# EAGLE design snow_@ (EAGLE 5.11)

## Sheet 1 of 3
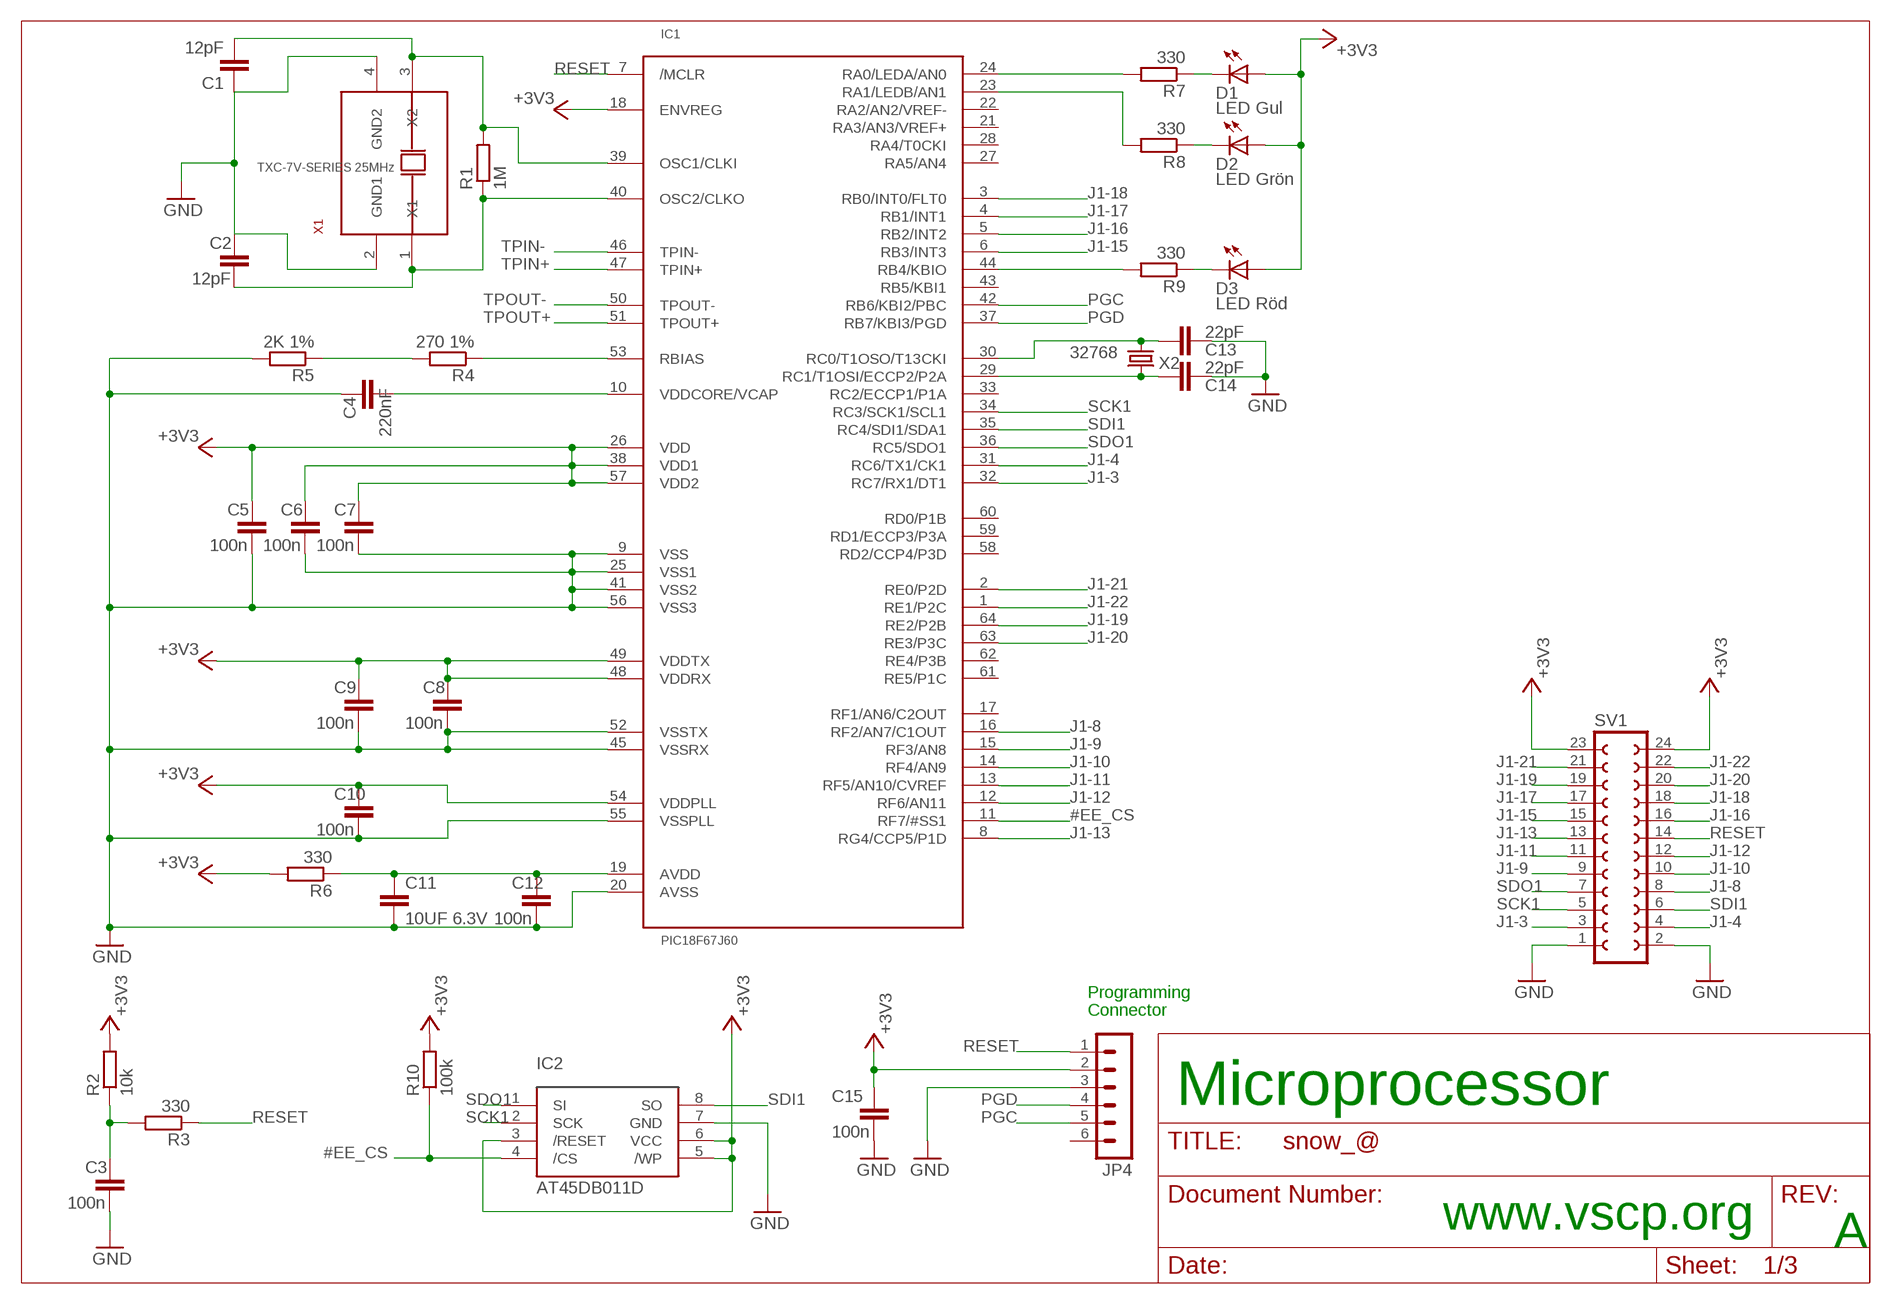
[diagram p0: schematic, sheet 1]

### Parts
C1  12pF  C-EUC0805  [C0805]
C2  12pF  C-EUC0805  [C0805]
C3  100n  C-EUC0805  [C0805]
C4  220nF  C-EUC0805  [C0805]
C5  100n  C-EUC0805  [C0805]
C6  100n  C-EUC0805  [C0805]
C7  100n  C-EUC0805  [C0805]
C8  100n  C-EUC0805  [C0805]
C9  100n  C-EUC0805  [C0805]
C10  100n  C-EUC0805  [C0805]
C11  10UF 6.3V  C-EUC2012  [C2012]
C12  100n  C-EUC0805  [C0805]
C13  22pF  C-EUC0805  [C0805]
C14  22pF  C-EUC0805  [C0805]
C15  100n  C-EUC0805  [C0805]
D1  LED Gul  LED_2012  [C2012]
D2  LED Grön  LED_2012  [C2012]
D3  LED Röd  LED_2012  [C2012]
IC1  PIC18F67J60  [TQFP64-10X10]
IC2  AT45DB011D  [SOP8]
JP4  MA06-1  [MA06-1]
R1  1M  R-EU_M0805  [M0805]
R2  10k  R-EU_M0805  [M0805]
R3  330  R-EU_M0805  [M0805]
R4  270 1%  R-EU_M0805  [M0805]
R5  2K 1%  R-EU_M0805  [M0805]
R6  330  R-EU_M0805  [M0805]
R7  330  R-EU_M0805  [M0805]
R8  330  R-EU_M0805  [M0805]
R9  330  R-EU_M0805  [M0805]
R10  100k  R-EU_M0805  [M0805]
SV1  FE12-2  [FE12-2]
X1  TXC-7V-SERIES 25MHz  TXC-7V-SERIES  [TXC-7V-SERIES]
X2  32768  CRYSTALTC26H  [TC26H]

### Nets
#EE_CS: IC1.11(RF7/#SS1) IC2.4(/CS) R10.1
+3V3: C5.1 C6.1 C7.1 C8.1 C9.1 C10.1 C15.1 D1.1(A) D2.1(A) D3.1(A) IC1.18(ENVREG) IC1.26(VDD) IC1.38(VDD1) IC1.48(VDDRX) IC1.49(VDDTX) IC1.54(VDDPLL) IC1.57(VDD2) IC2.3(/RESET) IC2.5(/WP) IC2.6(VCC) JP4.2 R2.2 R6.2 R10.2 SV1.23 SV1.24 ; also sheet 2,3
GND: C1.1 C2.1 C3.2 C4.1 C5.2 C6.2 C7.2 C8.2 C9.2 C10.2 C11.2 C12.2 C13.1 C14.1 C15.2 IC1.9(VSS) IC1.20(AVSS) IC1.25(VSS1) IC1.41(VSS2) IC1.45(VSSRX) IC1.52(VSSTX) IC1.55(VSSPLL) IC1.56(VSS3) IC2.7(GND) JP4.3 R5.2 SV1.1 SV1.2 X1.2(GND1) X1.4(GND2) ; also sheet 2,3
J1-3: IC1.32(RC7/RX1/DT1) SV1.3
J1-4: IC1.31(RC6/TX1/CK1) SV1.4
J1-8: IC1.16(RF2/AN7/C1OUT) SV1.8
J1-9: IC1.15(RF3/AN8) SV1.9
J1-10: IC1.14(RF4/AN9) SV1.10
J1-11: IC1.13(RF5/AN10/CVREF) SV1.11
J1-12: IC1.12(RF6/AN11) SV1.12
J1-13: IC1.8(RG4/CCP5/P1D) SV1.13
J1-15: IC1.6(RB3/INT3) SV1.15
J1-16: IC1.5(RB2/INT2) SV1.16
J1-17: IC1.4(RB1/INT1) SV1.17
J1-18: IC1.3(RB0/INT0/FLT0) SV1.18
J1-19: IC1.64(RE2/P2B) SV1.19
J1-20: IC1.63(RE3/P3C) SV1.20
J1-21: IC1.2(RE0/P2D) SV1.21
J1-22: IC1.1(RE1/P2C) SV1.22
N$3: C1.2 IC1.39(OSC1/CLKI) R1.2 X1.3(X2)
N$4: C2.2 IC1.40(OSC2/CLKO) R1.1 X1.1(X1)
N$5: IC1.53(RBIAS) R4.1
N$6: R4.2 R5.1
N$7: C14.2 IC1.29(RC1/T1OSI/ECCP2/P2A) X2.2
N$8: C3.1 R2.1 R3.2
N$9: C4.2 IC1.10(VDDCORE/VCAP)
N$10: C13.2 IC1.30(RC0/T1OSO/T13CKI) X2.1
N$11: IC1.24(RA0/LEDA/AN0) R7.2
N$12: IC1.23(RA1/LEDB/AN1) R8.2
N$13: IC1.44(RB4/KBIO) R9.2
N$14: D3.2(C) R9.1
N$15: D2.2(C) R8.1
N$16: D1.2(C) R7.1
N$23: C11.1 C12.1 IC1.19(AVDD) R6.1
PGC: IC1.42(RB6/KBI2/PBC) JP4.5
PGD: IC1.37(RB7/KBI3/PGD) JP4.4
RESET: IC1.7(/MCLR) JP4.1 R3.1 SV1.14
SCK1: IC1.34(RC3/SCK1/SCL1) IC2.2(SCK) SV1.5
SDI1: IC1.35(RC4/SDI1/SDA1) IC2.8(SO) SV1.6
SDO1: IC1.36(RC5/SDO1) IC2.1(SI) SV1.7
TPIN+: IC1.47(TPIN+)
TPIN-: IC1.46(TPIN-)
TPOUT+: IC1.51(TPOUT+)
TPOUT-: IC1.50(TPOUT-)
Unconnected: IC1.17(RF1/AN6/C2OUT) IC1.21(RA3/AN3/VREF+) IC1.22(RA2/AN2/VREF-) IC1.27(RA5/AN4) IC1.28(RA4/T0CKI) IC1.33(RC2/ECCP1/P1A) IC1.43(RB5/KBI1) IC1.58(RD2/CCP4/P3D) IC1.59(RD1/ECCP3/P3A) IC1.60(RD0/P1B) IC1.61(RE5/P1C) IC1.62(RE4/P3B) JP4.6

### Notes on the sheet
- Programming
- Connector
- Microprocessor
- www.vscp.org
- A

## Sheet 2 of 3
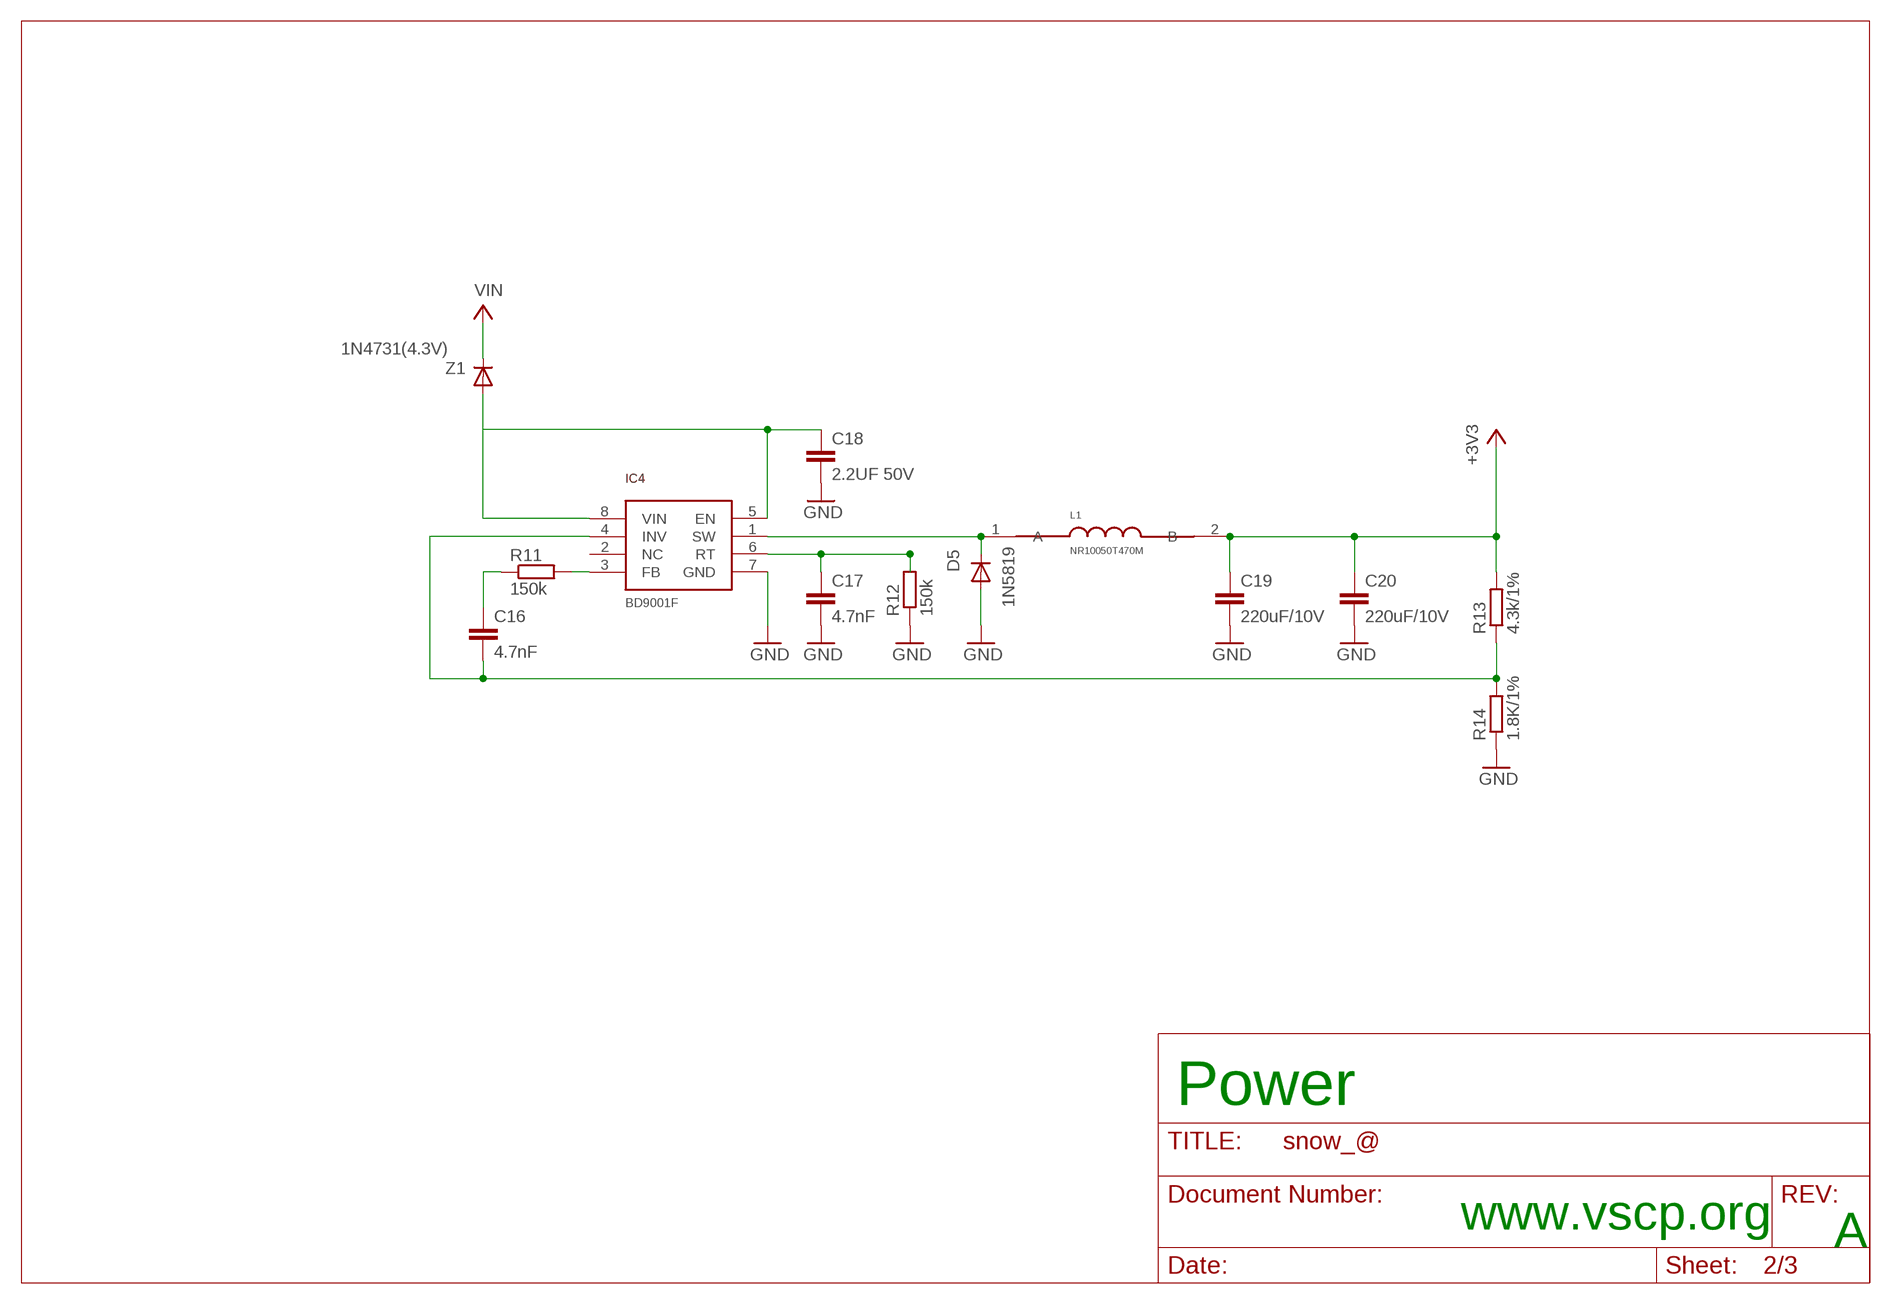
[diagram p1: schematic, sheet 2]

### Parts
C16  4.7nF  C-EUC0805  [C0805]
C17  4.7nF  C-EUC0805  [C0805]
C18  2.2UF 50V  C-EUC2012  [C2012]
C19  220uF/10V  C-EUC2012  [C2012]
C20  220uF/10V  C-EUC2012  [C2012]
D5  1N5819  [SOD-123]
IC4  BD9001F  [SOP8]
L1  NR10050T470M  [NR10050T470M]
R11  150k  R-EU_M0805  [M0805]
R12  150k  R-EU_M0805  [M0805]
R13  4.3k/1%  R-EU_M0805  [M0805]
R14  1.8K/1%  R-EU_M0805  [M0805]
Z1  1N4731(4.3V)  [1N4731]

### Nets
+3V3: C19.1 C20.1 L1.2(B) R13.2 ; also sheet 1,3
GND: C17.2 C18.2 C19.2 C20.2 D5.A IC4.7(GND) R12.1 R14.1 ; also sheet 1,3
N$17: IC4.3(FB) R11.2
N$18: C16.1 R11.1
N$19: C16.2 IC4.4(INV) R13.1 R14.2
N$20: C17.1 IC4.6(RT) R12.2
N$21: C18.1 IC4.5(EN) IC4.8(VIN) Z1.A
N$22: D5.C IC4.1(SW) L1.1(A)
V+: Z1.C ; supply symbol labelled VIN ; also sheet 3
Unconnected: IC4.2(NC)

### Notes on the sheet
- Power
- www.vscp.org
- A

## Sheet 3 of 3
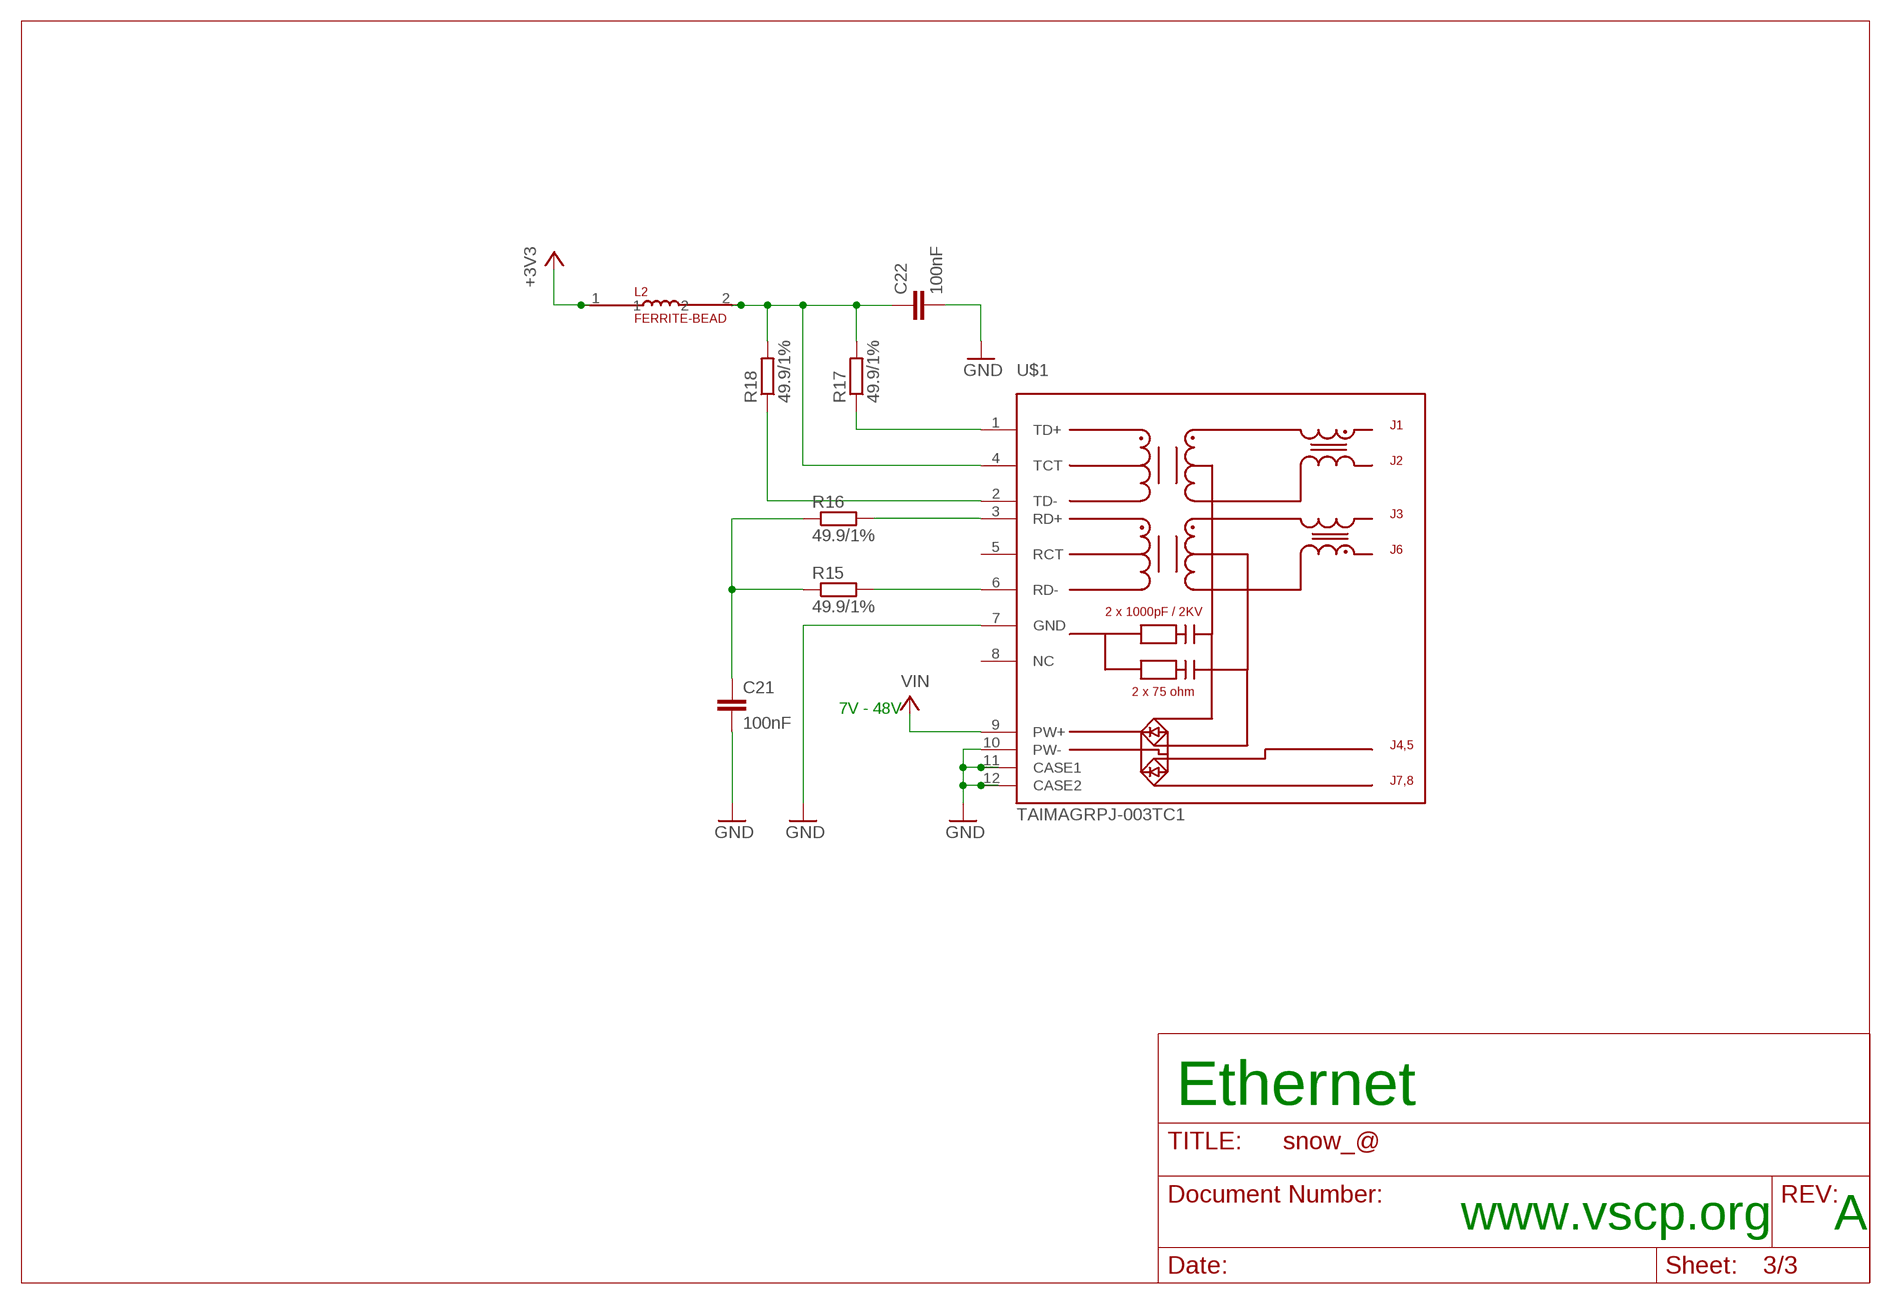
[diagram p2: schematic, sheet 3]

### Parts
C21  100nF  C-EUC0805  [C0805]
C22  100nF  C-EUC0805  [C0805]
L2  FERRITE-BEAD  [0805]
R15  49.9/1%  R-EU_M0805  [M0805]
R16  49.9/1%  R-EU_M0805  [M0805]
R17  49.9/1%  R-EU_M0805  [M0805]
R18  49.9/1%  R-EU_M0805  [M0805]
U$1  TAIMAGRPJ-003TC1  [TAIMAGRJP-003TC1]

### Nets
+3V3: L2.1 ; also sheet 1,2
GND: C21.2 C22.2 U$1.7(GND) U$1.10(PW-) U$1.11(CASE1) U$1.12(CASE2) ; also sheet 1,2
N$25: R16.2 U$1.3(RD+)
N$26: R15.2 U$1.6(RD-)
N$27: C21.1 R15.1 R16.1
N$29: R17.1 U$1.1(TD+)
N$30: R18.1 U$1.2(TD-)
N$31: C22.1 L2.2 R17.2 R18.2 U$1.4(TCT)
V+: U$1.9(PW+) ; supply symbol labelled VIN ; also sheet 2
Unconnected: U$1.5(RCT) U$1.8(NC)

### Notes on the sheet
- 7V - 48V
- Ethernet
- www.vscp.org | A

## Library data of the parts
C1-C22 = rcl:C-EU: CAPACITOR, European symbol
D1-D3 = snow:LED_2012
D5 = snow:1N5819
IC1 = snow:PIC18F67J60
IC2 = snow:AT45DB011D
IC4 = snow:BD9001F
JP4 = con-lstb:MA06-1: PIN HEADER; OC_FARNELL: unknown; OC_NEWARK: unknown
L1 = snow:NR10050T470M
L2 = snow:FERRITE-BEAD
R1-R18 = rcl:R-EU_: RESISTOR, European symbol
SV1 = con-lsta:FE12-2: FEMALE HEADER; OC_FARNELL: unknown; OC_NEWARK: unknown
U$1 = snow:TAIMAGRPJ-003TC1
X1 = snow:TXC-7V-SERIES
X2 = crystal:CRYSTAL: CRYSTAL; OC_FARNELL: unknown; OC_NEWARK: unknown
Z1 = snow:1N4731(4.3V)

## Board
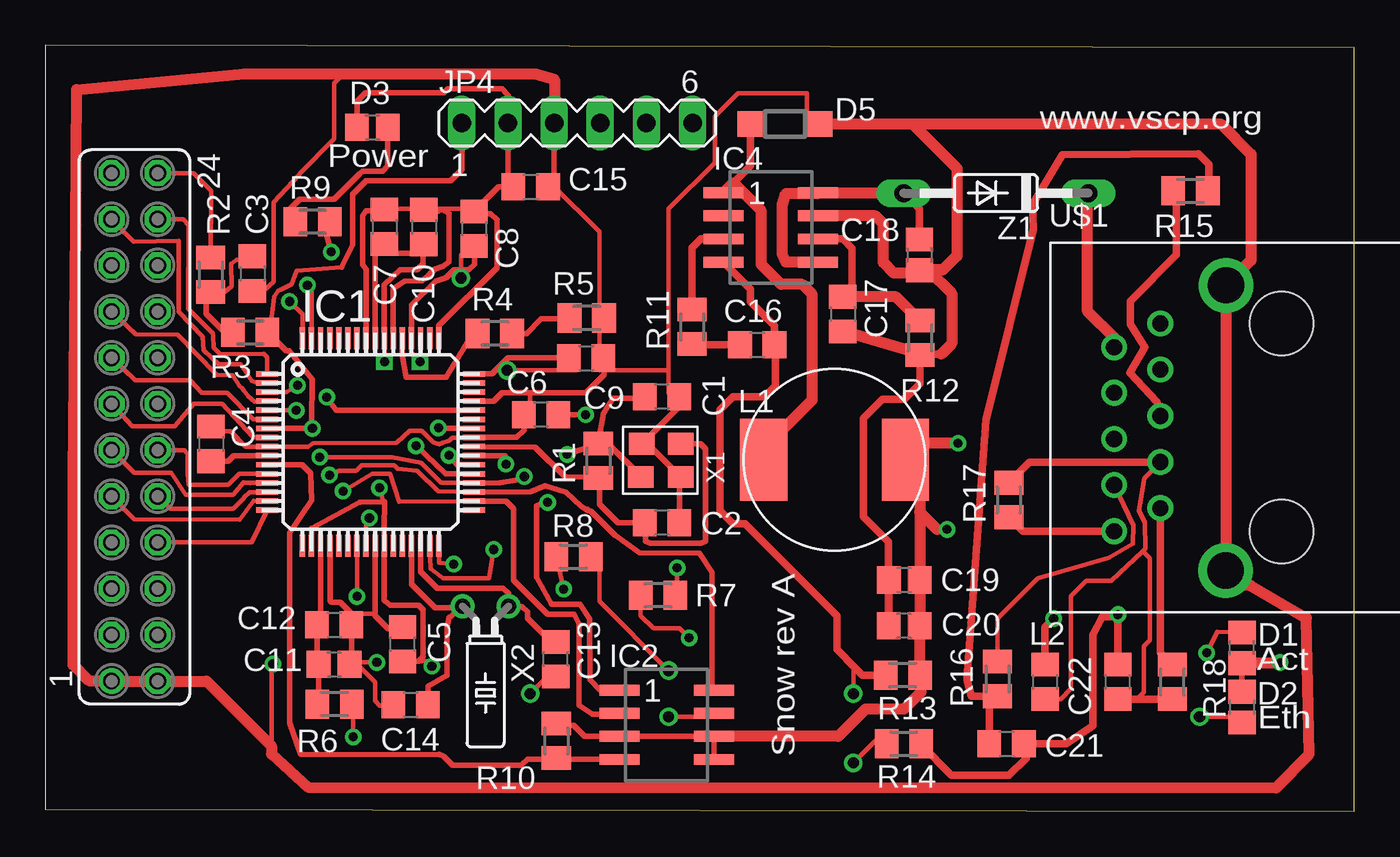
[diagram p3: board, top side]
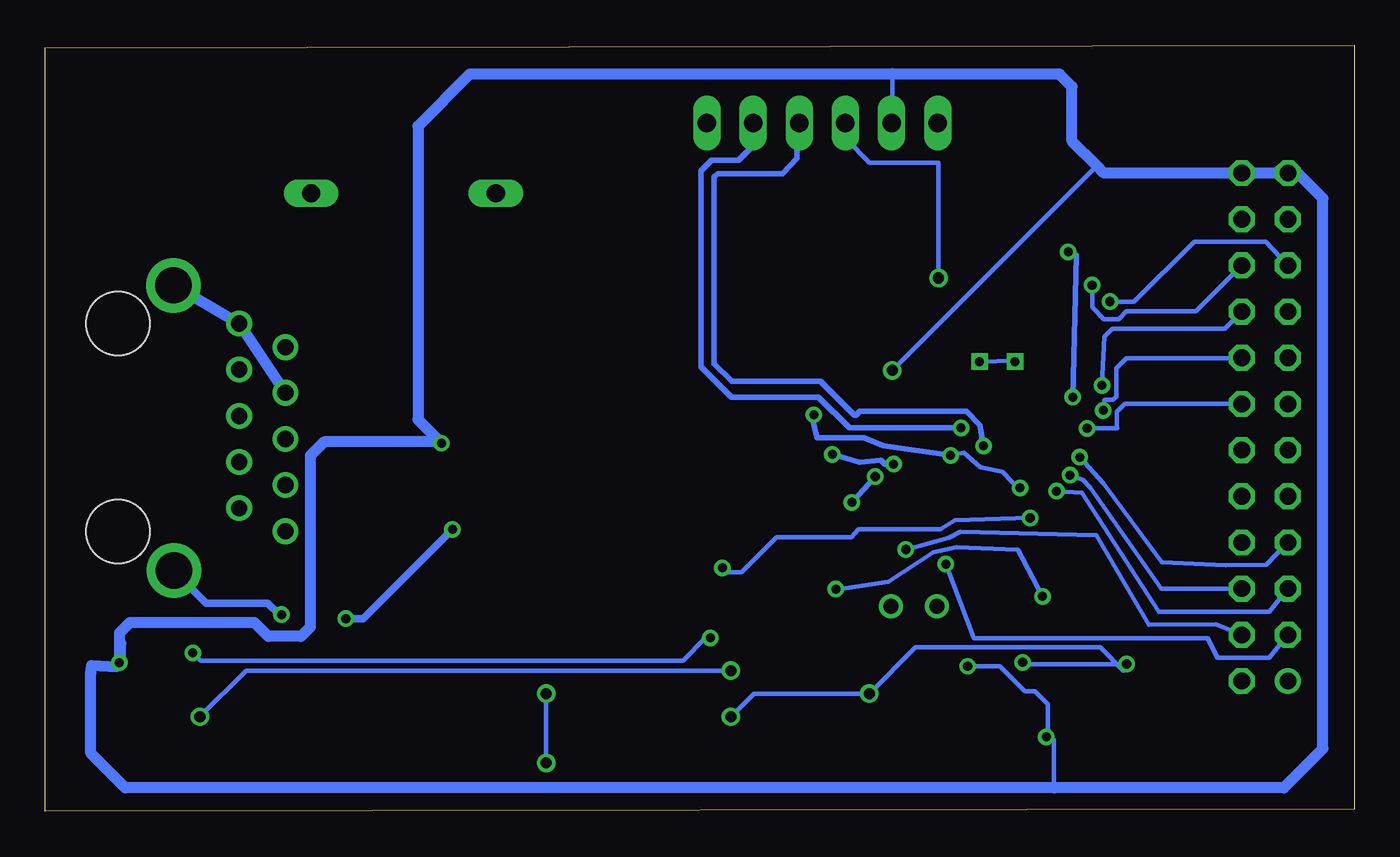
[diagram p4: board, bottom side, seen from below]

Size 72 x 42.12 mm. Coordinates in mm from the lower left corner, seen from the top.
Outline: 0,0.12 72,0 72,42 0,42.12 0,0.12
Copper layers (1*16): Top 0.0356mm / dielectric 1.5011mm / Bottom 0.0356mm
Design rules "SilverCircuits": minimum track width 7mil, minimum drill 14mil, track to track 7mil, track to pad 7mil, pad to pad 7mil, via to via 7mil, smd to smd 0mil, copper to edge 20mil, drill to drill 8mil, minimum pad ring 10mil, minimum via ring 8mil, stop-mask expansion 4mil, vias tented up to drill 0mil, thermal gap 10mil

### Footprints (pad centres in the part's own frame; a part is rotated, then mirrored left to right if it is on the bottom)
C0805 = smd 1.3 x 1.5: 1 -0.95,0; 2 0.95,0
C2012 = smd 1.3 x 1.5: 1 -0.85,0; 2 0.85,0
SOD-123 = smd 1.4 x 1.4: A 1.9,0; C -1.9,0
TQFP64-10X10 = smd 1.2 x 0.3: 1 -5.7,3.75; 2 -5.7,3.25; 3 -5.7,2.75; 4 -5.7,2.25; 5 -5.7,1.75; 6 -5.7,1.25; 7 -5.7,0.75; 8 -5.7,0.25; 9 -5.7,-0.25; 10 -5.7,-0.75; 11 -5.7,-1.25; 12 -5.7,-1.75; 13 -5.7,-2.25; 14 -5.7,-2.75; 15 -5.7,-3.25; 16 -5.7,-3.75; 33 5.7,-3.75; 34 5.7,-3.25; 35 5.7,-2.75; 36 5.7,-2.25; 37 5.7,-1.75; 38 5.7,-1.25; 39 5.7,-0.75; 40 5.7,-0.25; 41 5.7,0.25; 42 5.7,0.75; 43 5.7,1.25; 44 5.7,1.75; 45 5.7,2.25; 46 5.7,2.75; 47 5.7,3.25; 48 5.7,3.75 | smd 0.3 x 1.2: 17 -3.75,-5.7; 18 -3.25,-5.7; 19 -2.75,-5.7; 20 -2.25,-5.7; 21 -1.75,-5.7; 22 -1.25,-5.7; 23 -0.75,-5.7; 24 -0.25,-5.7; 25 0.25,-5.7; 26 0.75,-5.7; 27 1.25,-5.7; 28 1.75,-5.7; 29 2.25,-5.7; 30 2.75,-5.7; 31 3.25,-5.7; 32 3.75,-5.7; 49 3.75,5.7; 50 3.25,5.7; 51 2.75,5.7; 52 2.25,5.7; 53 1.75,5.7; 54 1.25,5.7; 55 0.75,5.7; 56 0.25,5.7; 57 -0.25,5.7; 58 -0.75,5.7; 59 -1.25,5.7; 60 -1.75,5.7; 61 -2.25,5.7; 62 -2.75,5.7; 63 -3.25,5.7; 64 -3.75,5.7
SOP8 = smd 0.6 x 2.2: 1 -1.905,-2.6; 2 -0.635,-2.6; 3 0.635,-2.6; 4 1.905,-2.6; 5 1.905,2.6; 6 0.635,2.6; 7 -0.635,2.6; 8 -1.905,2.6
MA06-1 = drill 1.016 long: 1 -6.35,0; 2 -3.81,0; 3 -1.27,0; 4 1.27,0; 5 3.81,0; 6 6.35,0
NR10050T470M = smd 2.6 x 4.5: 1 -3.9,0; 2 3.9,0
0805 = smd 1.3 x 1.5: 1 -0.95,0; 2 0.95,0
M0805 = smd 1.3 x 1.6: 1 -0.95,0; 2 0.95,0
FE12-2 = drill 0.914 round: 1 -13.97,1.27 | drill 0.914 octagon: 2 -13.97,-1.27; 3 -11.43,1.27; 4 -11.43,-1.27; 5 -8.89,1.27; 6 -8.89,-1.27; 7 -6.35,1.27; 8 -6.35,-1.27; 9 -3.81,1.27; 10 -3.81,-1.27; 11 -1.27,1.27; 12 -1.27,-1.27; 13 1.27,1.27; 14 1.27,-1.27; 15 3.81,1.27; 16 3.81,-1.27; 17 6.35,1.27; 18 6.35,-1.27; 19 8.89,1.27; 20 8.89,-1.27; 21 11.43,1.27; 22 11.43,-1.27; 23 13.97,1.27; 24 13.97,-1.27
TAIMAGRJP-003TC1 = drill 0.9 round: 1 -5.72,9.2; 2 -4.45,6.66; 3 -3.18,9.2; 4 -1.91,6.66; 5 -0.64,9.2; 6 0.63,6.66; 7 1.9,9.2; 8 3.17,6.66; 9 4.4,9.2; 10 5.7,6.66 | drill 2 round: 11 -7.88,3.07; 12 7.81,3.05 | hole 3.5: -5.72,0; 5.72,0
TXC-7V-SERIES = smd 1.4 x 1.2: 1 -1.07,-0.67; 2 1.07,-0.67; 3 1.13,1.17; 4 -1.07,1.17
TC26H = drill 0.813 round: 1 -1.27,0; 2 1.27,0
1N4731 = drill 1 long: A 5.08,0; C -5.08,0

### Placement (x,y rotation side)
C1  33.92,22.81 180 top
C2  33.92,15.87 180 top
C3  11.39,29.58 270 top
C4  9.11,20.21 270 top
C5  19.65,9.2 90 top
C6  27.27,21.82 180 top
C7  18.65,32.15 270 top
C8  23.59,32.05 270 top
C9  29.75,24.93 0 top
C10  20.82,32.14 270 top
C11  15.88,8.09 0 top
C12  15.89,10.26 0 top
C13  28.08,8.37 90 top
C14  20.09,5.87 0 top
C15  26.7,34.35 0 top
C16  39.16,25.66 0 top
C17  43.87,27.35 270 top
C18  48.08,30.61 270 top
C19  47.26,12.72 180 top
C20  47.24,10.21 180 top
C21  52.88,3.72 0 top
C22  59,7.12 90 top
D1  65.83,9 90 top
D2  65.83,5.73 270 top
D3  17.99,37.62 0 top
D5  40.69,37.81 0 top
IC1  17.89,20.32 0 top
IC2  34.17,4.76 270 top
IC4  39.91,32.12 270 top
JP4  29.25,37.86 0 top
L1  43.42,19.34 0 top
L2  55,7.12 270 top
R1  30.42,19.29 90 top
R2  9.09,29.52 90 top
R3  11.26,26.35 180 top
R4  24.72,26.28 0 top
R5  29.79,27.14 0 top
R6  15.9,5.89 0 top
R7  33.7,11.88 0 top
R8  29.05,14.01 180 top
R9  14.7,32.42 0 top
R10  28.11,3.88 90 top
R11  35.58,26.65 90 top
R12  48.12,26.04 90 top
R13  47.17,7.49 0 top
R14  47.23,3.72 180 top
R15  63,34.12 180 top
R16  52.38,7.29 90 top
R17  53,17.12 90 top
R18  62,7.12 270 top
SV1  4.91,21.14 90 top
U$1  68,21.12 90 top
X1  33.89,19.56 180 top
X2  24.21,11.28 180 top
Z1  52.3,34 180 top

### Tracks (layer width: path | path; a pad name or v marks a point on that pad's centre or on a via)
#EE_CS
  Top 0.305: IC2.4 28.18,2.85 R10.1 28.11,2.89 28.09,2.88 26.53,2.88 26.18,2.53 22.41,2.53 21.92,3.02 21.67,3.14 21.7,3.12 14.04,3.15 13.42,4.88 13.42,15.32 14.64,17.11 14.58,18.6 14.12,19.06 IC1.11
+3V3  (via drill 0.5, 0.61)
  Top 0.254: R2.2 9.12,34.14 8.15,35.11 SV1.24 | C5.1 21,8.24 v21.26,7.98 | v16.94,4.1 16.94,5.81 R6.2 | v18.38,17.79 18.63,16.8 18.66,17.02 | C7.1 19.05,33.15 20.32,33.15 C10.1 | 21.59,33.09 21.59,33.15 22.86,33.15 C8.1 | v25.4,24.25 29.21,24.25 C9.1
  Top 0.305: IC1.57 17.64,29.82 17.46,30.07 17.46,32.75 17.66,33.04 18.59,33.04 C7.1 | 21.51,33.09 21.59,33.09 21.82,33.09 22.21,32.88 22.22,30.22 21.88,29.98 21.4,29.81 21.07,29.5 21.05,29.45 20.71,29.17 19.76,29.16 19.13,28.73 19.13,26.06 IC1.54 | 21.51,33.09 C10.1 | IC1.49 21.64,26.7 24.84,29.9 24.84,32.54 24.5,32.88 23.7,32.88 C8.1 24.94,34.35 C15.1 25.44,34.66 JP4.2 25.46,37.87 25.46,39.38 25.11,39.73 22.14,39.73 21.93,39.52 17.61,39.52 17.14,39.05 D3.1 | IC1.48 24.58,24.07 25.46,24.94 C9.1 | IC1.38 22.64,19.07 v22.21,19.58 | v29.72,21.81 C6.1 | C5.1 20.52,8.24 20.77,8.5 20.77,11.08 20.52,11.33 18.96,11.33 18.63,11.62 18.63,14.6 IC1.26 18.64,15.56 18.66,17.02 17.28,17 14.64,15.58 IC1.18 | R10.2 28.2,4.74 29.06,4.74 29.67,4.12 IC2.3 IC2.6 IC2.5 | 21.51,33.09 21.61,32.99 | D1.1 D2.1 | D1.1 | 48.18,6.56 48.18,7.43 R13.2
  Top 0.406: L1.2 47.32,18.84 47.32,18.05 48.1,17.26 | C19.1 | 48.11,10.22 C20.1 | 48.09,7.52 R13.2 | L2.1 55,10.13 v55.47,10.6 | 49.05,15.51 v49.61,15.51
  Top 0.61: 48.1,16.46 C19.1 | 48.1,17.26 48.1,16.46 | C19.1 48.11,10.22 | C20.1 48.09,7.52 | 48.1,16.46 49.05,15.51 | IC2.6 43.62,4.12 45.12,5.63 47.24,5.63 48.18,6.56 | v50.21,20.25 47.5,20.25 47.36,20.39 47.36,18.88 47.32,18.84 | D1.1 67.9,8.15 v67.93,8.18
  Bottom 0.254: v21.26,7.98 19.49,7.98 18.11,6.6 17.56,6.6 R6.2 16.86,4.18 v16.94,4.1 16.51,3.94 16.51,1.3 | v22.21,19.58 21.45,19.73 20.55,18.93 19.34,18.68 18.31,17.58 v18.38,17.79 | v25.4,24.25 14.16,35.5 14.03,35.64 | JP4.2 25.4,38.23 25.4,40.55 25.4,40.77
  Bottom 0.305: v22.21,19.58 25.91,20.1 26.97,20.54 29.56,20.54 29.79,21.6 v29.71,21.82 v29.72,21.81
  Bottom 0.406: v55.47,10.6 54.52,10.6 v49.61,15.51
  Bottom 0.61: v67.93,8.18 67.93,9.81 67.35,10.38 60.5,10.38 59.74,9.63 57.93,9.63 57.43,10.13 57.43,19.56 56.67,20.32 50.28,20.32 v50.21,20.25 51.51,21.55 51.51,37.7 48.65,40.55 25.4,40.55 16.21,40.55 15.52,39.86 15.52,36.86 14.16,35.5 13.77,35.11 SV1.24 SV1.23 3.11,35.11 1.71,33.71 1.71,3.45 3.87,1.3 16.51,1.3 67.61,1.3 69.5,3.19 69.5,7.6 69.46,8.03 68.06,7.96 68.06,8.07 67.96,8.17 67.94,8.17 67.88,8.23 67.88,8.25 67.86,8.28 67.86,9.23 67.93,9.31
GND  (via drill 0.5, 0.61)
  Top 0.254: 16.84,10.86 18.13,10.86 18.14,10.85 | 16.84,8.19 17.03,8.19 18.13,7.09 18.13,6.08 18.39,5.82 19.09,5.82 C14.1 | 12.44,3.59 12.44,8.03 v12.51,8.11 | v18.23,8.2 16.84,8.2 C11.2 | C3.2 11.97,28.6 12.55,29.14 12.55,33.5 13.97,35.05 13.97,35.07 15.89,36.98 15.89,40.05 16.39,40.56 | C4.1 9.36,20.91 10.18,20.91 11.02,20.07 IC1.9 14.46,20.07 14.73,20.26 19.33,20.27 20.05,20.92 20.7,20.92 21.33,20.3 21.66,20.19 21.86,20.29 22.2,20.38 22.37,20.56 23.57,20.55 IC1.41 | 30.48,26.8 30.48,25.52 C9.2 30.48,24.25 34.29,24.25 | 26.67,23.03 26.67,21.71 C6.2 | 34.29,24.25 34.29,22.98 C1.1 | v26.67,6.47 27.94,7.75 C13.1 | v34.29,5.21 36.83,5.21 IC2.7 | v22.86,29.34 22.86,30.61 C8.2 | 30.48,26.8 30.48,31.88 27.94,34.41 C15.2 | 30.48,26.8 R5.2 | 34.29,24.25 34.29,33.15 36.83,35.69 36.83,38.23 38.1,39.49 41.91,39.49 41.91,38.23 D5.A | 21.47,29.14 21.31,29.01 20.12,27.82 20.17,25.51 20.12,25.46 20.12,25.26 v20.6,24.74 | v18.66,24.73 18.66,26 IC1.55
  Top 0.305: C2.1 34.87,18.3 X1.4 33.12,20.23 X1.2 34.87,22.28 C1.1 | C15.2 27.98,34.68 JP4.3 28,37.88 | 18.14,30.69 IC1.56 | 18.14,30.69 C7.2 | IC1.55 18.64,25.7 18.63,25.65 18.63,28.98 19.51,29.8 20.45,29.8 20.78,30.12 20.78,31.14 C10.2 | IC1.52 20.15,27.86 21.47,29.14 22.04,29.34 22.49,29.78 23.29,29.78 23.61,30.1 23.61,31.07 C8.2 | IC1.41 25.92,20.57 26.33,20.97 C6.2 | IC1.45 24.67,22.57 25.14,23.03 26.67,23.03 29.75,23.03 30.73,24.02 30.73,24.9 C9.2 | IC1.25 18.14,10.85 18.14,10.76 18.84,10.06 19.57,10.06 C5.2 | IC1.20 15.66,14.6 15.66,11.58 15.74,11.49 16.21,11.49 16.84,10.86 C12.2 16.84,8.19 C11.2 | C10.2 20.91,31.09 | 18.14,30.69 20.32,30.69 C10.2
  Top 0.406: C22.2 v59,10.82 v59.01,10.82 58.89,10.71 58.16,10.71 57.63,9.71 57.63,4.72 56.16,3.72 C21.2 53.97,3.58 53.97,2.93 53.01,1.98 49.86,1.98 48.18,3.65 R14.1 | 47.93,29.61 C18.2 48.59,29.76 48.61,29.78 | 49.29,25.15 48.17,25.15 R12.1 | R12.1 48.01,25.2 | D5.A 47.71,37.81 | C19.2 46.41,10.22 C20.2 46.39,14.82 45,16.21 45,21.62 46.05,22.68 47.25,22.68 48.1,23.53 48.1,25.08 R12.1
  Top 0.61: U$1.11 U$1.12 66.33,30.31 66.33,36.15 64.67,37.81 D5.A | IC4.7 45.67,32.75 46.1,32.32 46.1,30.19 46.68,29.61 47.93,29.61 | 48.59,29.76 49.87,28.48 49.87,25.73 49.29,25.15 | 48.01,25.2 C17.2 | 47.71,37.81 50.15,35.37 50.15,30.56 49.37,29.78 48.61,29.78 | 64.75,13.31 65.62,12.44 66.27,12.44 69.38,10.63 69.52,3.15 67.71,1.3 14.45,1.33 12.44,3.16 12.44,3.59 8.86,7.17 SV1.2 SV1.1 3.61,7.2 2.38,7.2 1.53,8.05 1.53,18.41 1.67,32.21 1.72,39.69 10.92,40.56 16.39,40.56 26.96,40.56 28,40.26 28,37.88
  Bottom 0.254: v18.23,8.2 18.26,8.11 v12.51,8.11 12.7,7.75 13.97,9.02 24.13,9.02 v26.67,6.47 33.02,6.47 v34.29,5.21 | v22.86,29.34 22.86,35.69 26.67,35.69 27.94,36.95 JP4.3 | v20.6,24.74 18.69,24.78 v18.66,24.73
  Bottom 0.406: v59.01,10.82 59.12,10.82 59.76,11.46 63.14,11.46 U$1.11
  Bottom 0.61: U$1.7 U$1.10 U$1.12
J1-3  (via drill 0.5)
  Top 0.254: IC1.32 21.66,13.68 v22.46,13.6
  Bottom 0.254: v22.46,13.6 20.92,9.53 11.93,9.53 8.04,9.52 7.51,8.45 4.66,8.45 SV1.3
J1-4  (via drill 0.5)
  Top 0.254: v24.66,14.4 24.41,12.81 21.88,12.81 21.2,13.36 IC1.31
  Bottom 0.254: SV1.4 7.62,10.28 11.29,10.26 14.19,15.2 21.66,15.38 22.28,15.05 v24.66,14.4
J1-8
  Top 0.254: IC1.16 11.34,14.81 SV1.8
J1-9
  Top 0.254: IC1.15 11.45,17.09 10.7,16.05 4.88,16.07 SV1.9
J1-10
  Top 0.254: IC1.14 11.23,17.57 10.94,17.28 10.94,17.26 10.34,16.65 6.85,16.65 SV1.10
J1-11
  Top 0.254: IC1.13 10.94,18.09 11.27,18.06 10.92,18.1 10.33,17.41 7.71,17.41 6.92,18.61 4.89,18.61 SV1.11
J1-12
  Top 0.254: IC1.12 10.67,18.57 10.06,17.96 7.89,17.96 7.83,18.58 7.83,19.61 7.67,19.85 6.2,19.85 SV1.12
J1-13
  Top 0.254: IC1.8 11.41,20.57 9.73,22.42 8.15,22.42 7.1,21.17 4.77,21.17 SV1.13
J1-15
  Top 0.254: IC1.6 11.44,21.57 9.99,23.01 8.6,23.01 7.97,23.71 4.95,23.71 SV1.15
J1-16  (via drill 0.5)
  Top 0.254: IC1.5 13.73,22.07 v13.8,22.06
  Bottom 0.254: v13.8,22.06 13.74,22.59 13.7,22.63 13.27,22.63 13.09,22.81 13.09,24.38 12.54,24.92 6.2,24.92 SV1.16
J1-17
  Top 0.254: IC1.4 11.51,22.53 11.14,22.83 10.94,23.13 10.81,23.29 10.69,23.38 10.29,24 9.43,24 7.27,26.22 4.96,26.23 SV1.17
J1-18  (via drill 0.5)
  Top 0.254: IC1.3 13.23,23.07 v13.88,23.43
  Bottom 0.254: v13.88,23.43 13.74,26.1 13.29,26.55 7.11,26.55 SV1.18
J1-19  (via drill 0.5)
  Top 0.254: IC1.64 14.14,27.33 v13.43,28.04
  Bottom 0.254: v13.43,28.04 12.12,28.04 8.79,31.32 4.85,31.32 SV1.19
J1-20  (via drill 0.5)
  Top 0.254: IC1.63 14.64,28.71 v14.41,28.94
  Bottom 0.254: v14.41,28.94 14.41,27.73 13.76,27.08 12.95,27.08 12.53,27.5 8.71,27.5 SV1.20
J1-21
  Top 0.254: IC1.2 11.62,23.57 11.35,23.68 10.75,24.61 9.53,24.59 8.72,25.36 8.65,26.11 7.32,27.47 7.33,31.38 4.85,31.33 SV1.21
J1-22
  Top 0.254: IC1.1 12.19,24.99 12,25.18 9.62,25.15 9.25,25.51 9.24,26.16 9.2,26.32 9.21,26.29 7.84,27.66 7.89,32.24 7.57,32.56 SV1.22
N$3  (via drill 0.5)
  Top 0.305: R1.2 30.71,21.91 31.24,22.73 32.9,22.73 C1.2 | X1.3 32.76,18.42 30.99,20.19 30.46,20.19 R1.2 | IC1.39 25.3,19.57 v25.34,19.09 | v28.7,19.64 30.37,20.19 R1.2
  Bottom 0.305: v25.34,19.09 25.82,19.09 26.04,19.32 27.22,19.2 v28.7,19.64
N$4
  Top 0.305: X1.1 36.03,20.23 36.32,19.94 36.32,14.86 36.08,14.76 33.29,14.76 33.02,14.86 33.02,15.82 C2.2 31.5,15.87 30.48,16.89 30.48,18.27 R1.1 30.34,18.41 28.6,18.39 26.93,20.03 IC1.40
N$5
  Top 0.305: R4.1 23.51,26.28 22.04,23.88 19.85,23.88 19.62,25.15 19.62,26 IC1.53
N$6
  Top 0.305: R4.2 26.46,26.28 27.28,27.09 28.8,27.09 R5.1
N$7
  Top 0.305: IC1.29 20.14,12.48 21.43,11.19 22.86,11.19 X2.2 22.31,10.72 22.2,10.67 22.11,10.14 22.11,7.5 21.04,6.87 C14.2
N$8
  Top 0.254: R2.1 9.89,28.57 10.24,28.89 10.23,30.12 10.51,30.33 11.07,30.33 C3.1
  Top 0.305: R3.2 9.86,26.35 8.84,27.37 8.84,28.76 R2.1
N$9
  Top 0.305: IC1.10 10.35,19.57 10.05,19.27 9.12,19.27 C4.2
N$10
  Top 0.305: IC1.30 20.64,13.17 21.54,12.27 25.19,12.27 25.47,11.99 25.47,11.29 X2.1 25.5,11.26 26.24,11.26 26.51,10.98 26.51,10.63 27.83,9.32 C13.2
N$11  (via drill 0.5)
  Top 0.254: IC1.24 17.64,15.83 v17.82,16.14 | v34.75,13.39 34.75,11.98 R7.2
  Bottom 0.254: v17.82,16.14 21.97,16.01 22.75,15.51 27.28,15.52 27.66,15.07 31.77,15.09 33.71,13.14 34.5,13.14 v34.75,13.39
N$12  (via drill 0.5)
  Top 0.254: IC1.23 v17.14,11.83 v17.15,11.83 | v28.51,12.22 28.11,14.02 R8.2
  Bottom 0.254: v17.15,11.83 18.49,14.4 21.89,14.53 23.13,14.25 25.61,12.64 28.33,12.21 v28.51,12.22
N$13  (via drill 0.5)
  Top 0.305: IC1.44 16,22.07 v15.48,22.78 | v15.72,30.77 15.29,32.4 R9.2
  Bottom 0.305: v15.48,22.78 15.27,30.6 v15.72,30.77
N$14
  Top 0.305: R9.1 13.4,33.09 13.97,33.66 15.89,33.66 17.29,35.06 | 17.29,35.06 | 17.29,35.06 17.44,35.21 18.55,35.21 18.84,35.5 D3.2
N$15  (via drill 0.61)
  Top 0.254: v63.5,5.21 66.04,5.21 D2.2 | v34.29,7.75 30.48,11.55 30.48,14.1 R8.1
  Bottom 0.254: v63.5,5.21 60.96,7.75 v34.29,7.75
N$16  (via drill 0.5)
  Top 0.254: R7.1 32.75,10.77 33.46,10.06 34.89,10.06 v35.41,9.54 | v63.89,8.72 64.48,9.87 D1.2
  Bottom 0.254: v35.41,9.54 35.67,9.54 36.93,8.28 63.45,8.28 v63.89,8.72
N$17
  Top 0.406: IC4.3 36.06,31.48 35.58,31 R11.2
N$18
  Top 0.406: C16.1 35.62,25.66 R11.1
N$19  (via drill 0.61)
  Top 0.254: v44.45,2.67 45.72,3.94 R14.2 | v44.45,6.47 44.45,7.75 44.58,7.87
  Top 0.406: R13.1 44.96,7.49 44.58,7.87 43.54,8.91 43.54,10.77 38.49,15.82 37.83,15.82 37.11,16.54 37.11,22.08 37.83,22.8 39.57,22.8 40.18,23.4 40.18,25.6 C16.2 40.11,26.71 38.79,28.03 38.79,28.73 IC4.4
  Bottom 0.254: v44.45,2.67 v44.45,6.47
N$20
  Top 0.406: IC4.6 43.88,31.48 44.39,30.98 44.39,28.82 C17.1
  Top 0.61: C17.1 46.8,28.3 R12.2
N$21
  Top 0.406: 47.2,34.02 Z1.A 48.08,33.14 C18.1 | 42.48,33.99 IC4.8
  Top 0.61: IC4.8 47.2,34.02 | IC4.5 40.73,30.21 40.55,30.65 40.55,33.37 40.75,33.99 42.48,33.99
N$22
  Top 0.406: D5.C 38.79,35.5 37.85,34.56 | L1.1 39.52,19.96
  Top 0.61: IC4.1 37.85,34.56 39.39,33.02 39.39,30.08 40.47,28.99 41.64,28.99 42.19,28.44 42.19,22.63 39.52,19.96
N$23
  Top 0.305: IC1.19 15.14,10.47 C12.1 14.94,8.19 C11.1 15.03,5.97 R6.1
N$25
  Top 0.254: R16.2 52.38,10.6 54.61,12.82 58.5,13.95 59.82,14.71 59.85,15.73 U$1.3
N$26
  Top 0.406: U$1.6 61.14,22.53 59.65,24.14 60.48,25.52 59.69,26.8 59.69,28.07 62.23,30.61 62.23,33.95 R15.2
N$27
  Top 0.406: C21.1 51.93,5.88 R16.1 50.94,6.33 50.69,7.25 51.75,21.51 54.37,32.02 54.3,33.35 55.94,36.13 63.42,36.17 64,35.59 64,34.17 R15.1
N$29
  Top 0.406: U$1.1 53.77,15.4 R17.1
N$30
  Top 0.406: U$1.2 61.34,8.73 R18.1
N$31
  Top 0.254: L2.2 55.86,6.17 56.42,6.74 56.42,11.83 57.28,12.7 58.65,12.7 60.37,14.31 | 60.37,14.31 60.51,14.44 60.48,15.91 60.15,16.54 60.46,18.34 U$1.4 | C22.1 60.04,6.17 60.42,6.56 60.42,9.07 60.76,9.4 60.76,13.92 60.37,14.31
  Top 0.406: U$1.4 54.14,19.21 R17.2 | C22.1 R18.2
PGC  (via drill 0.5)
  Top 0.305: IC1.42 21.66,21.07 v21.63,21.09
  Bottom 0.305: v21.63,21.09 27.77,21.09 29.47,22.79 34.27,22.79 35.93,24.45 35.93,35.22 35.35,35.8 33.87,35.8 33.11,36.56 33.11,37.81 JP4.5
PGD  (via drill 0.5)
  Top 0.305: IC1.37 22.02,18.57 v20.39,20.1
  Bottom 0.305: v20.39,20.1 20.58,21.23 21.34,21.99 27.19,21.99 27.41,21.78 27.48,21.78 29.36,23.66 34.23,23.66 35.21,24.63 35.21,34.9 34.99,35.08 31.45,35.08 30.66,35.91 30.66,37.72 JP4.4
RESET  (via drill 0.5)
  Top 0.254: 16.29,29.92 13.81,29.73 13.55,28.99 12.94,28.7 12.82,28.63 12.59,28.3 12.37,26.51 R3.1 | v14.69,21.06 14.58,21.38 14.65,21.39
  Top 0.305: IC1.7 13.25,21.07 v14.69,21.06 14.65,21.39 14.66,23.75 13.4,25.32 13.24,25.32 R3.1 | 16.29,29.92 16.91,31.17 16.91,33.95 17.64,34.68 22.3,34.68 22.93,35.31 22.93,37.83 JP4.1
  Bottom 0.254: SV1.14 12.62,22.41 13.04,21.99 13.04,21.08 13.03,21.07 14.42,21.07 v14.69,21.06
SCK1  (via drill 0.5)
  Top 0.254: IC1.34 19.46,17.02 18.98,18.56 17.98,18.57 v16.38,17.61
  Top 0.305: IC1.34 25.34,17.07 25.75,16.66 25.75,12.72 27.63,10.84 29.09,10.84 29.37,10.32 29.37,5.83 30.1,5.34 31.52,5.34 IC2.2
  Bottom 0.254: v16.38,17.61 14.98,17.52 10.74,10.99 4.67,10.99 SV1.5
SDI1  (via drill 0.5)
  Top 0.254: IC1.35 21.6,17.59 20.45,18.73 19.37,18.83 19.18,19.03 17.39,19.03 17.1,18.73 16.16,18.73 v15.63,18.49
  Top 0.305: IC1.35 26.7,17.58 27.48,17.92 28.64,17.55 29.47,16.79 29.85,16.53 29.84,16.61 30.03,16.52 31.35,15.19 31.32,15.22 32.68,14.21 35.98,14.19 36.67,13.14 36.67,6.76 IC2.8
  Bottom 0.254: v15.63,18.49 14.93,18.24 14.49,17.8 10.61,12.24 SV1.6
SDO1  (via drill 0.5)
  Top 0.254: IC1.36 21.87,18.06 21.77,18.06 20.66,19.17 19.08,19.49 v15.09,19.48
  Top 0.305: IC2.1 30.52,6.67 29.96,7.23 29.95,10.6 29.43,11.38 27.85,11.38 27.01,12.87 27.01,16.81 v27.63,17 | v26.35,18.42 26.04,18.25 25,18.08 23.6,18.05 IC1.36
  Bottom 0.254: v15.09,19.48 13.81,18.05 10.57,13.71 7.06,13.54 4.83,13.56 SV1.7
  Bottom 0.305: v26.35,18.42 v27.63,17
V+
  Top 0.406: 57.34,33.96 Z1.C
  Top 0.61: U$1.9 58.8,26.04 57.34,27.51 57.34,33.96

### Text on the board
tNames: www.vscp.org | Power | Snow rev A | Act | Eth